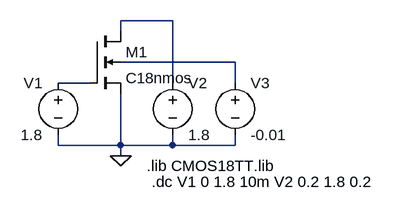
[diagram p0: schematic nmosChar.asc]
nmosChar.asc, the LTspice schematic file:
Version 4
SHEET 1 880 680
WIRE 272 64 192 64
WIRE 192 80 192 64
WIRE 368 128 192 128
WIRE 144 160 96 160
WIRE 272 160 272 64
WIRE 368 160 368 128
WIRE 96 256 96 240
WIRE 192 256 192 176
WIRE 192 256 96 256
WIRE 272 256 272 240
WIRE 272 256 192 256
WIRE 368 256 368 240
WIRE 368 256 272 256
WIRE 192 272 192 256
FLAG 192 272 0
SYMBOL nmos4 144 80 R0
SYMATTR InstName M1
SYMATTR Value C18nmos
SYMATTR Value2 l=180n w=220n m=1
SYMBOL voltage 96 144 M0
WINDOW 123 0 0 Left 0
WINDOW 39 0 0 Left 0
SYMATTR InstName V1
SYMATTR Value 1.8
SYMBOL voltage 272 144 R0
SYMATTR InstName V2
SYMATTR Value 1.8
SYMBOL voltage 368 144 R0
WINDOW 123 0 0 Left 0
WINDOW 39 0 0 Left 0
SYMATTR InstName V3
SYMATTR Value -0.01
TEXT 232 288 Left 2 !.lib CMOS18TT.lib
TEXT 240 312 Left 2 !.dc V1 0 1.8 10m V2 0.2 1.8 0.2

The netlist it stands for:
* nmosChar.asc
M1 N001 N003 0 N002 C18nmos l=180n w=220n m=1
V1 N003 0 1.8
V2 N001 0 1.8
V3 N002 0 -0.01
.model NMOS NMOS
.model PMOS PMOS
.lib standard.mos
.lib CMOS18TT.lib
.dc V1 0 1.8 10m V2 0.2 1.8 0.2
.backanno
.end